# EAGLE design smd2nes (EAGLE 4.16)
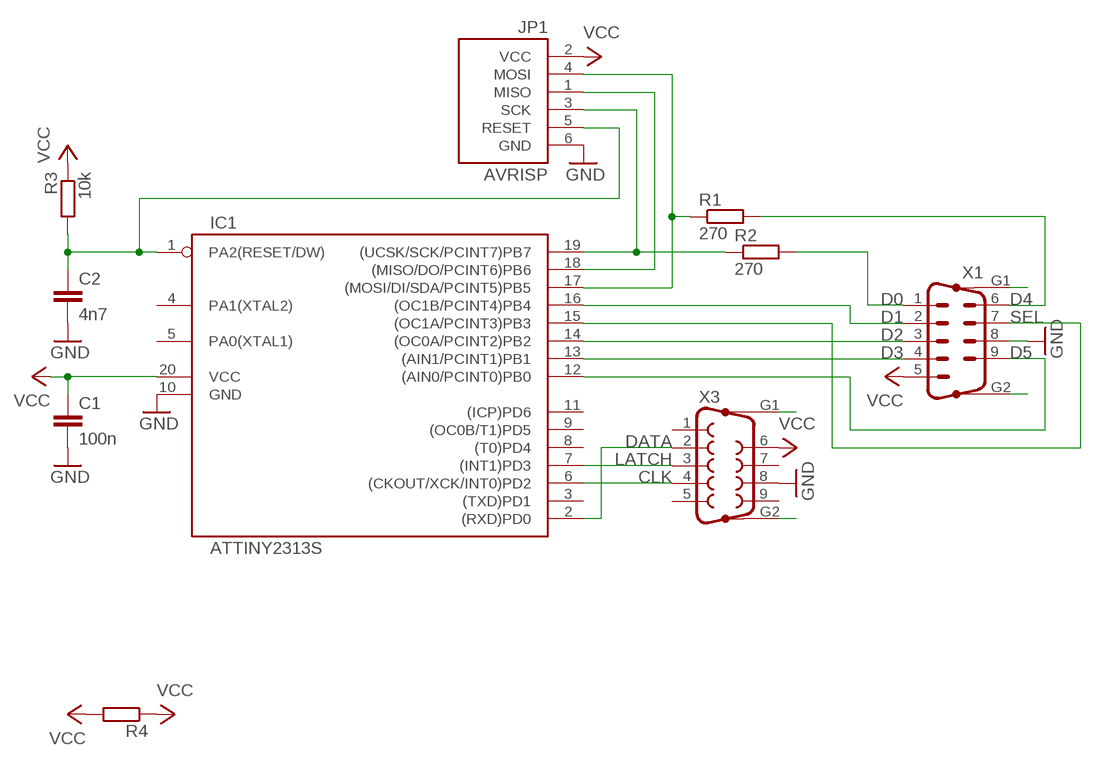
[diagram p0: schematic, sheet 1]

## Parts
C1  100n  C-EUC0805  [C0805]
C2  4n7  C-EUC0805  [C0805]
IC1  ATTINY2313S  [SOIC20]
JP1  AVRISP  [2X3]
R1  270  R-EU_R0805  [R0805]
R2  270  R-EU_R0805  [R0805]
R3  10k  R-EU_R0805  [R0805]
R4  R-EU_M1206  [M1206]
X1  M09HP  [M09HP]
X3  F09HP  [F09HP]

## Nets
CLK: IC1.6((CKOUT/XCK/INT0)PD2) X3.4
D0: R2.2 X1.1
D1: IC1.16((OC1B/PCINT4)PB4) X1.2
D2: IC1.14((OC0A/PCINT2)PB2) X1.3
D3: IC1.13((AIN1/PCINT1)PB1) X1.4
D4: R1.2 X1.6
D5: IC1.12((AIN0/PCINT0)PB0) X1.9
DATA: IC1.2((RXD)PD0) X3.2
G1: X1.G1 X3.G1
G2: X1.G2 X3.G2
GND: C1.2 C2.2 IC1.10(GND) JP1.6(GND) X1.8 X3.8
LATCH: IC1.7((INT1)PD3) X3.3
N$9: C2.1 IC1.1(PA2(RESET/DW)) JP1.5(RESET) R3.2
N$11: IC1.17((MOSI/DI/SDA/PCINT5)PB5) JP1.4(MOSI) R1.1
N$12: IC1.19((UCSK/SCK/PCINT7)PB7) JP1.3(SCK) R2.1
N$13: IC1.18((MISO/DO/PCINT6)PB6) JP1.1(MISO)
SEL: IC1.15((OC1A/PCINT3)PB3) X1.7
VCC: C1.1 IC1.20(VCC) JP1.2(VCC) R3.1 R4.1 R4.2 X1.5 X3.6
Unconnected: IC1.3((TXD)PD1) IC1.4(PA1(XTAL2)) IC1.5(PA0(XTAL1)) IC1.8((T0)PD4) IC1.9((OC0B/T1)PD5) IC1.11((ICP)PD6) X3.1 X3.5 X3.7 X3.9

## Library data of the parts
C1 C2 = rcl:C-EU: CAPACITOR, European symbol
IC1 = avr:ATTINY2313
JP1 = avrprog:AVRISP: AVR in-system programmer 6-pin connector
R1-R4 = rcl:R-EU_: RESISTOR, European symbol
X1 = con-subd:M09HP: SUB-D
X3 = con-subd:F09HP: SUB-D

## Board
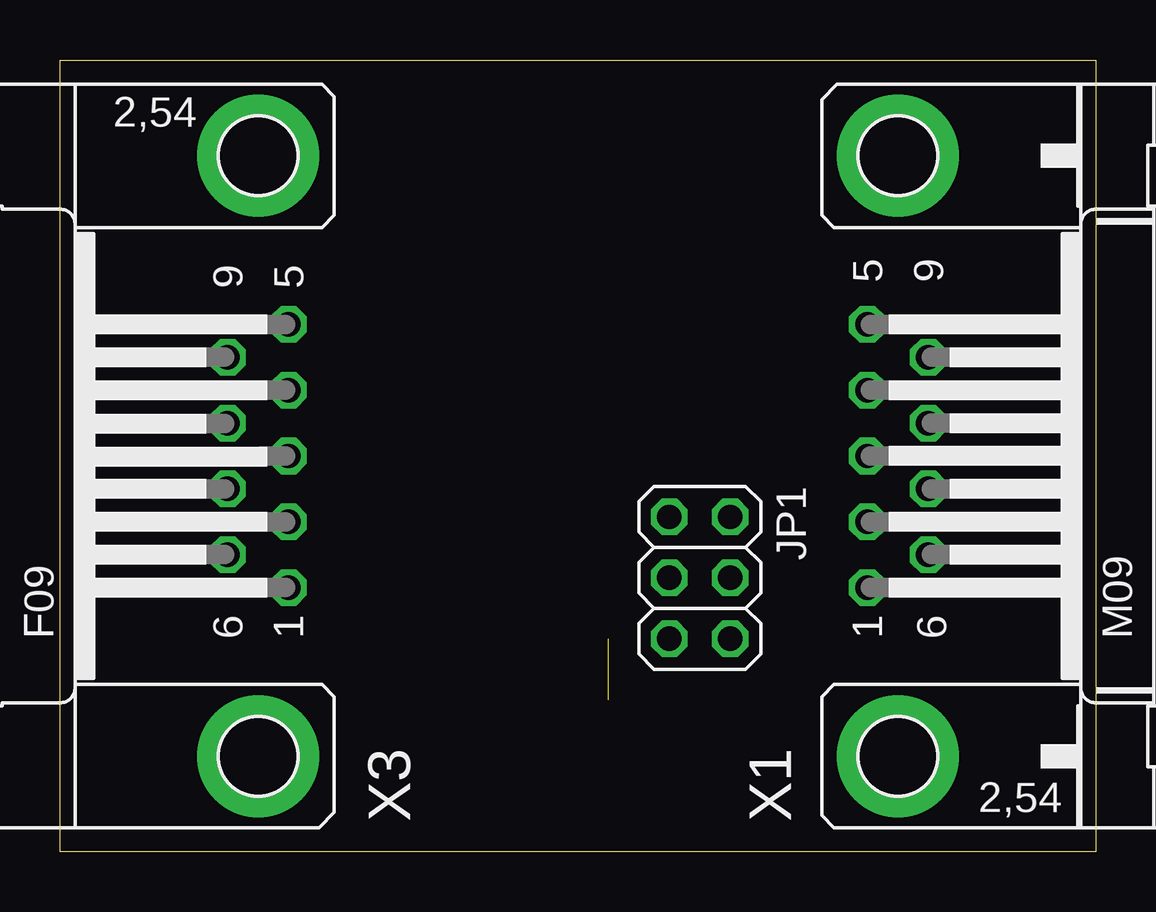
[diagram p1: board, top side]
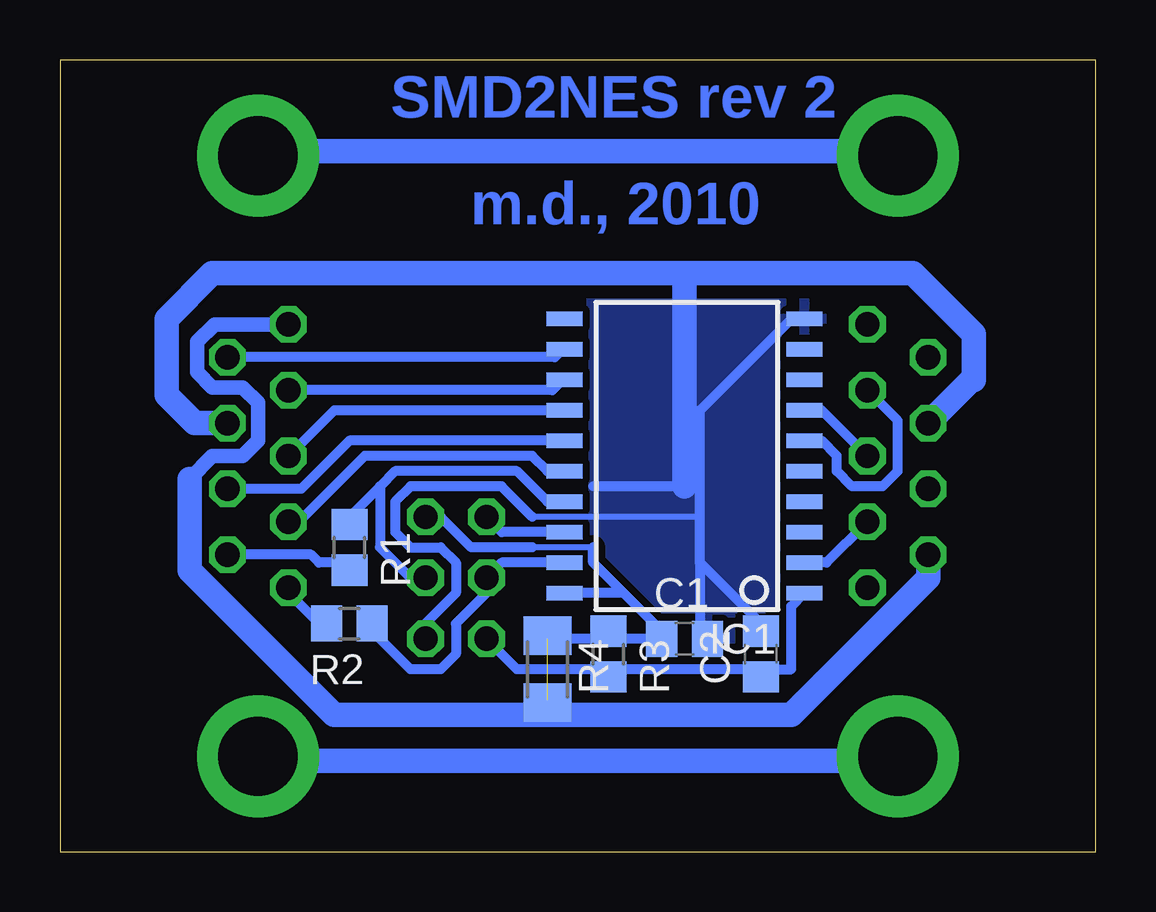
[diagram p2: board, bottom side, seen from below]

Size 43.18 x 33.02 mm. Coordinates in mm from the lower left corner, seen from the top.
Outline: 0,0 0,33.02 43.18,33.02 43.18,0 0,0
Copper layers (1*16): Top 0.035mm / dielectric 1.5mm / Bottom 0.035mm
Design rules "default": minimum track width 10mil, minimum drill 24mil, track to track 8mil, track to pad 0.17mm, pad to pad 8mil, via to via 8mil, smd to smd 8mil, copper to edge 40mil, drill to drill 8mil, minimum pad ring 10mil, minimum via ring 8mil, stop-mask expansion 4mil, vias tented up to drill 0mil, thermal gap 10mil

### Footprints (pad centres in the part's own frame; a part is rotated, then mirrored left to right if it is on the bottom)
C0805 = smd 1.3 x 1.5: 1 -0.95,0; 2 0.95,0
SOIC20 = smd 0.6 x 1.5: 1 -5.715,-5; 2 -4.445,-5; 3 -3.175,-5; 4 -1.905,-5; 5 -0.635,-5; 6 0.635,-5; 7 1.905,-5; 8 3.175,-5; 9 4.445,-5; 10 5.715,-5; 11 5.715,5; 12 4.445,5; 13 3.175,5; 14 1.905,5; 15 0.635,5; 16 -0.635,5; 17 -1.905,5; 18 -3.175,5; 19 -4.445,5; 20 -5.715,5
2X3 = drill 1.016 octagon: 1 -2.54,-1.27; 2 -2.54,1.27; 3 0,-1.27; 4 0,1.27; 5 2.54,-1.27; 6 2.54,1.27
R0805 = smd 1.3 x 1.5: 1 -0.95,0; 2 0.95,0
M1206 = smd 1.6 x 2: 1 -1.4,0; 2 1.4,0
M09HP = drill 1.016 octagon: 1 -5.486,1.27; 2 -2.743,1.27; 3 0,1.27; 4 2.743,1.27; 5 5.486,1.27; 6 -4.115,-1.27; 7 -1.372,-1.27; 8 1.372,-1.27; 9 4.115,-1.27 | drill 3.302 pad 5.08 round: G1 -12.522,0; G2 12.522,0
F09HP = drill 1.016 octagon: 1 -5.486,-1.27; 2 -2.743,-1.27; 3 0,-1.27; 4 2.743,-1.27; 5 5.486,-1.27; 6 -4.115,1.27; 7 -1.372,1.27; 8 1.372,1.27; 9 4.115,1.27 | drill 3.302 pad 5.08 round: G1 -12.522,0; G2 12.522,0

### Placement (x,y rotation side)
C1  17.14,8.89 0 bottom
C2  13.97,8.26 90 bottom
IC1  17.14,16.51 90 bottom
JP1  26.67,11.43 270 top
R1  31.11,12.7 270 bottom
R2  31.11,9.53 180 bottom
R3  20.32,8.26 270 bottom
R4  22.86,7.62 270 bottom
X1  34.93,16.51 90 top
X3  8.25,16.51 90 top

### Tracks (layer width: path | path; a pad name or v marks a point on that pad's centre or on a via)
CLK
  Bottom 0.406: IC1.6 11.43,17.15 10.8,16.51 10.8,15.88 10.16,15.24 8.89,15.24 8.25,15.88 8.25,17.78 8.25,17.98 X3.4
D0
  Bottom 0.406: R2.2 32.39,9.53 33.88,11.02 X1.1
D1
  Bottom 0.406: X1.2 33.22,13.77 30.48,16.51 23.5,16.51 22.86,15.88 IC1.16
D2
  Bottom 0.406: X1.3 31.75,18.42 IC1.14
D3
  Bottom 0.406: IC1.13 22.22,19.69 22.66,19.25 X1.4
D4
  Bottom 0.406: 31.11,12.06 arc-60 R1.2 31.11,12.06 | X1.6 32.72,12.39 32.39,12.06 31.11,12.06
D5
  Bottom 0.406: IC1.12 22.22,20.96 22.55,20.62 X1.9
DATA
  Bottom 0.406: X3.2 11.23,12.06 IC1.2
G1
  Bottom 1.016: X3.G1 8.43,3.81 34.75,3.81 X1.G1
G2
  Bottom 1.016: X3.G2 8.43,29.21 34.75,29.21 X1.G2
GND
  Bottom 0.254: 16.51,13.97 23.5,13.97
  Bottom 0.406: IC1.10 12.7,22.23 16.51,18.42 16.51,15.24 | C1.2 16.51,8.89 16.51,12.06 | 16.51,15.24 16.51,13.97 16.51,12.06 | C2.2 13.97,9.53 16.51,12.06 | 16.51,15.24 17.14,15.24 20.95,15.24 | JP1.6 27.94,9.53 26.67,10.79 26.67,12.06 27.3,12.7 28.57,12.7 29.21,13.33 29.21,14.61 28.57,15.24 24.77,15.24 23.5,13.97
  Bottom 1.016: 17.14,15.24 17.14,24.13 | 17.14,24.13 7.62,24.13 5.08,21.59 5.08,19.69 5.18,19.69 X3.8 | X1.8 37.57,17.88 38.73,19.05 38.73,22.23 36.83,24.13 17.14,24.13
  pour Bottom (isolate 0.305): 11.43,22.86 22.86,22.86 22.86,10.16 16.51,10.16 16.51,8.26 15.24,8.26 15.24,10.16 11.43,10.16
LATCH
  Bottom 0.406: IC1.7 11.43,18.42 X3.3
N$9
  Bottom 0.406: IC1.1 12.7,10.24 12.7,7.62 13.97,7.62 | C2.1 13.97,7.62 | 13.97,7.62 20.32,7.62 | 20.32,7.62 R3.2 | 20.32,7.62 24.13,7.62 JP1.5
N$11
  Bottom 0.406: 29.85,15.24 29.85,12.7 28.57,11.43 JP1.4 | IC1.17 22.86,14.61 24.13,15.88 29.21,15.88 29.85,15.24 | R1.1 31.11,13.97 29.85,15.24
N$12
  Bottom 0.406: IC1.19 24.77,12.06 JP1.3 25.4,10.79 26.67,9.53 26.67,8.26 27.3,7.62 28.57,7.62 29.85,8.89 29.85,9.53 R2.1
N$13
  Bottom 0.406: IC1.18 24.77,13.33 JP1.1
SEL
  Bottom 0.406: X1.7 33.12,15.14 31.11,17.15 IC1.15
VCC  (1 unrouted)
  Bottom 0.254: 20.95,12.7 23.5,12.7
  Bottom 0.406: 20.32,8.89 C1.1 17.78,8.89 19.68,10.79 | 19.68,10.79 IC1.20 | JP1.2 27.3,13.97 26.04,12.7 23.5,12.7 | 20.95,12.7 20.95,12.06 19.68,10.79 | R4.1 22.86,8.89 20.32,8.89 | 20.32,8.89 R3.1 | 22.86,5.71 R4.2
  Bottom 0.61: X1.5 36.74,22 37.47,21.27 37.47,20 36.83,19.37 35.56,19.37 34.93,18.73 34.93,17.15 35.56,16.51 36.83,16.51 37.78,15.56 | 31.11,5.71 31.43,5.71
  Bottom 1.016: R4.2 22.86,6.35 | X3.6 6.99,11.43 12.7,5.71 22.86,5.71 31.11,5.71 31.75,5.71 37.78,11.75 37.78,15.56

### Text on the board
Bottom: SMD2NES rev 2 | m.d., 2010